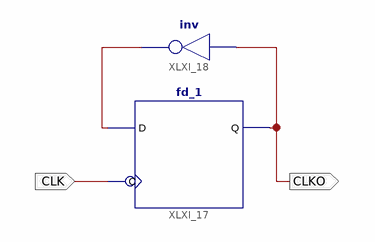
[diagram p0: schematic sheet 1]
// Xilinx ISE schematic clkdiv2.sch (spartan6) as structural Verilog: 2 symbols, 2 ports
module clkdiv2 (
  input  CLK,
  output CLKO
);

  wire XLXN_27;

  fd_1 XLXI_17 (.C(CLK), .D(XLXN_27), .Q(CLKO));
  not XLXI_18 (XLXN_27, CLKO);
endmodule
